# Altium schematic sheet DS12C887.SchDoc
size A4
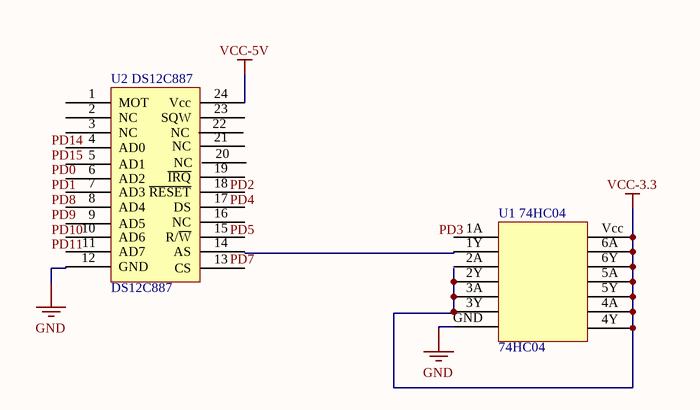
[diagram p0: DS12C887.SchDoc]

## Parts
U1_74HC04  74HC04
U2_DS12C887  DS12C887

## Nets
GND: U1_74HC04.GND U2_DS12C887.12(GND)
VCC-3.3: U1_74HC04.2Y U1_74HC04.3A U1_74HC04.3Y U1_74HC04.4A U1_74HC04.4Y U1_74HC04.5A U1_74HC04.5Y U1_74HC04.6A U1_74HC04.6Y U1_74HC04.Vcc
VCC-5V: U2_DS12C887.24(Vcc)

Not connected (* = marked no-connect by the designer): U1_74HC04 1A(1) 1Y(2) 2A(3); U2_DS12C887 1(MOT) 2(NC) 3(NC) 4(AD0) 5(AD1) 6(AD2) 7(AD3) 8(AD4) 9(AD5) 10(AD6) 11(AD7) 13(CS) 14(AS) 15(R/~{W}) 16(NC) 17(DS) 18(~{RESET}) 19(~{IRQ}) 20(NC) 21(NC) 22(NC) 23(SQW)

## Notes on the sheet
- Labels drawn without touching a wire or pin: PD0, PD1, PD2, PD3, PD4, PD5, PD7, PD8, PD9, PD10, PD11, PD14, PD15